# EAGLE design control (EAGLE 5.07)
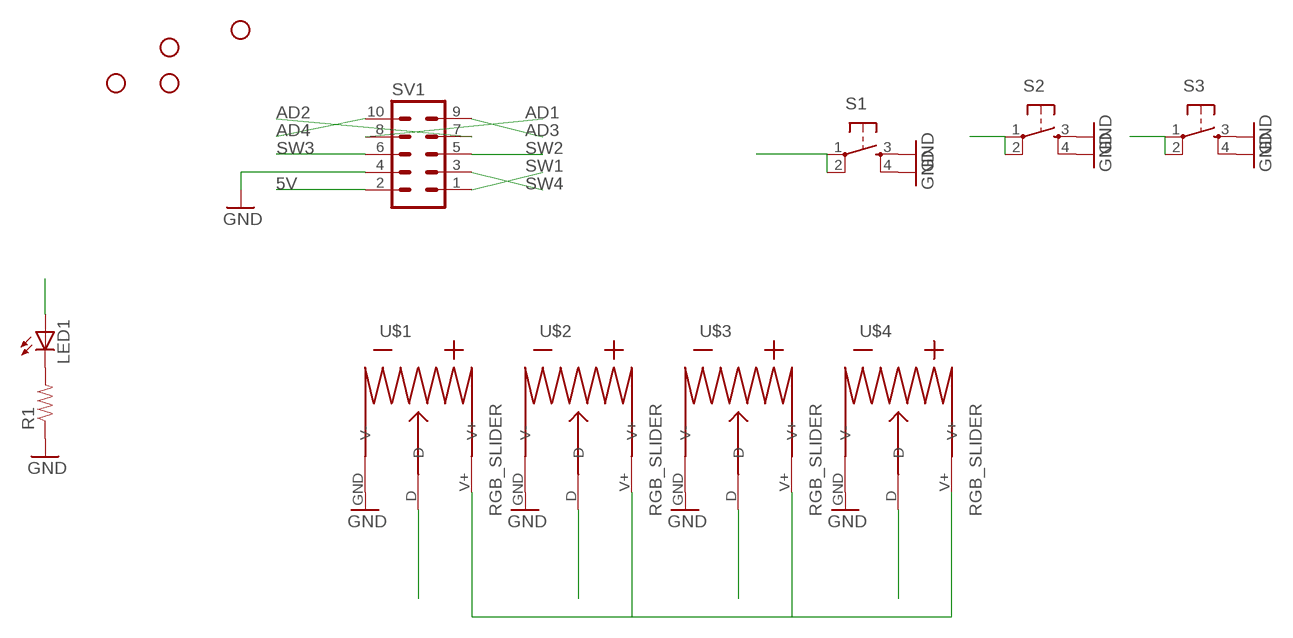
[diagram p0: schematic, sheet 1]

## Parts
JP1  STAND-OFF  [STAND-OFF]
JP2  STAND-OFF  [STAND-OFF]
JP3  STAND-OFF  [STAND-OFF]
JP4  STAND-OFF  [STAND-OFF]
LED1  LED5MM  [LED5MM]
R1  RESISTORPTH1  [AXIAL-0.3]
S1  TAC_SWITCHPTH  [TACTILE-PTH]
S2  TAC_SWITCHPTH  [TACTILE-PTH]
S3  TAC_SWITCHPTH  [TACTILE-PTH]
SV1  ML10  [ML10]
U$1  RGB_SLIDER  [RGB_SLIDER]
U$2  RGB_SLIDER  [RGB_SLIDER]
U$3  RGB_SLIDER  [RGB_SLIDER]
U$4  RGB_SLIDER  [RGB_SLIDER]

## Nets
5V: SV1.2 U$1.V+ U$2.V+ U$3.V+ U$4.V+
AD1: SV1.8 U$1.D
AD2: SV1.7 U$2.D
AD3: SV1.9 U$3.D
AD4: SV1.10 U$4.D
GND: R1.P$1 S1.3 S1.4 S2.3 S2.4 S3.3 S3.4 SV1.4 U$1.GND(V-) U$2.GND(V-) U$3.GND(V-) U$4.GND(V-)
N$1: LED1.K(C) R1.P$2
SW1: LED1.A SV1.1
SW2: S1.1 S1.2 SV1.5
SW3: S2.1 S2.2 SV1.6
SW4: S3.1 S3.2 SV1.3

## Library data of the parts
JP1-JP4 = SparkFun:STAND-OFF: Stand Off This is the mechanical footprint for a #4 phillips button head screw. Use the keepout ring to avoid running the screw head into surrounding components. SKU : PRT-00447
LED1 = SparkFun:LED: LEDs Standard schematic elements and footprints for 5mm, 3mm, 1206, and 0603 sized LEDs. 5mm - Spark Fun Electronics SKU : COM-00529 (and others)
R1 = SparkFun:RESISTOR: Resistor Basic schematic elements and footprints for 0603, 1206, and PTH 1/10th watt (small) resistors.
S1-S3 = SparkFun:TAC_SWITCH: Momentary Switch Button commonly used for reset or general input. Spark Fun Electronics SKU : COM-00097
SV1 = con-harting-ml:ML10: HARTING
U$1-U$4 = RGB_SLIDER:RGB_SLIDER

## Board
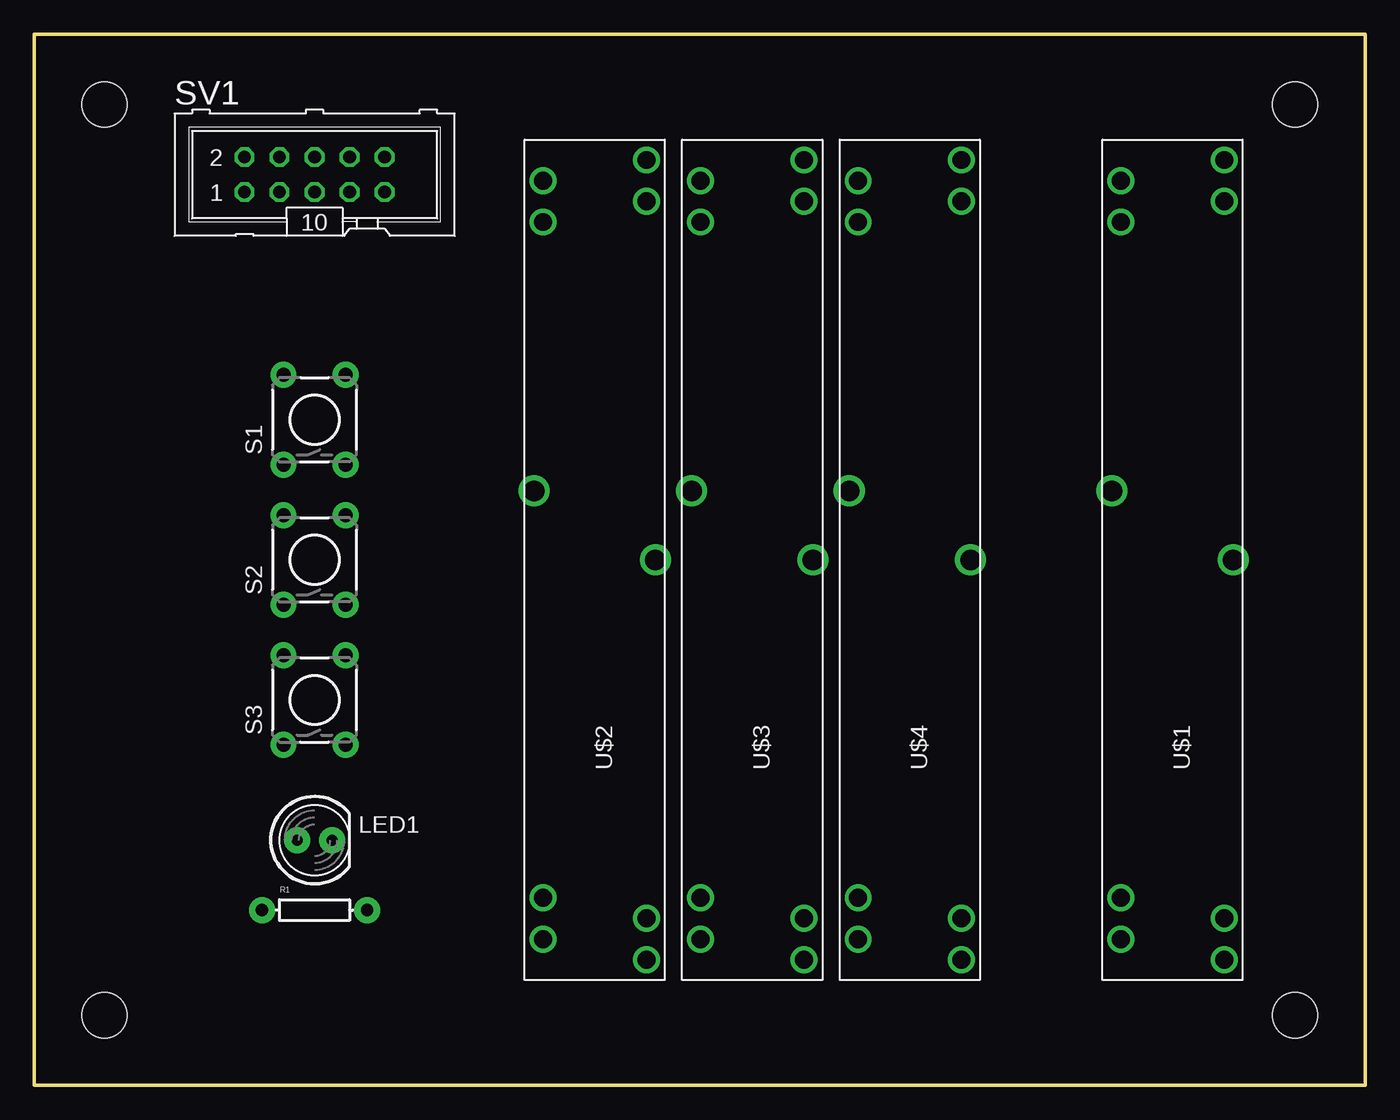
[diagram p1: board, top side]
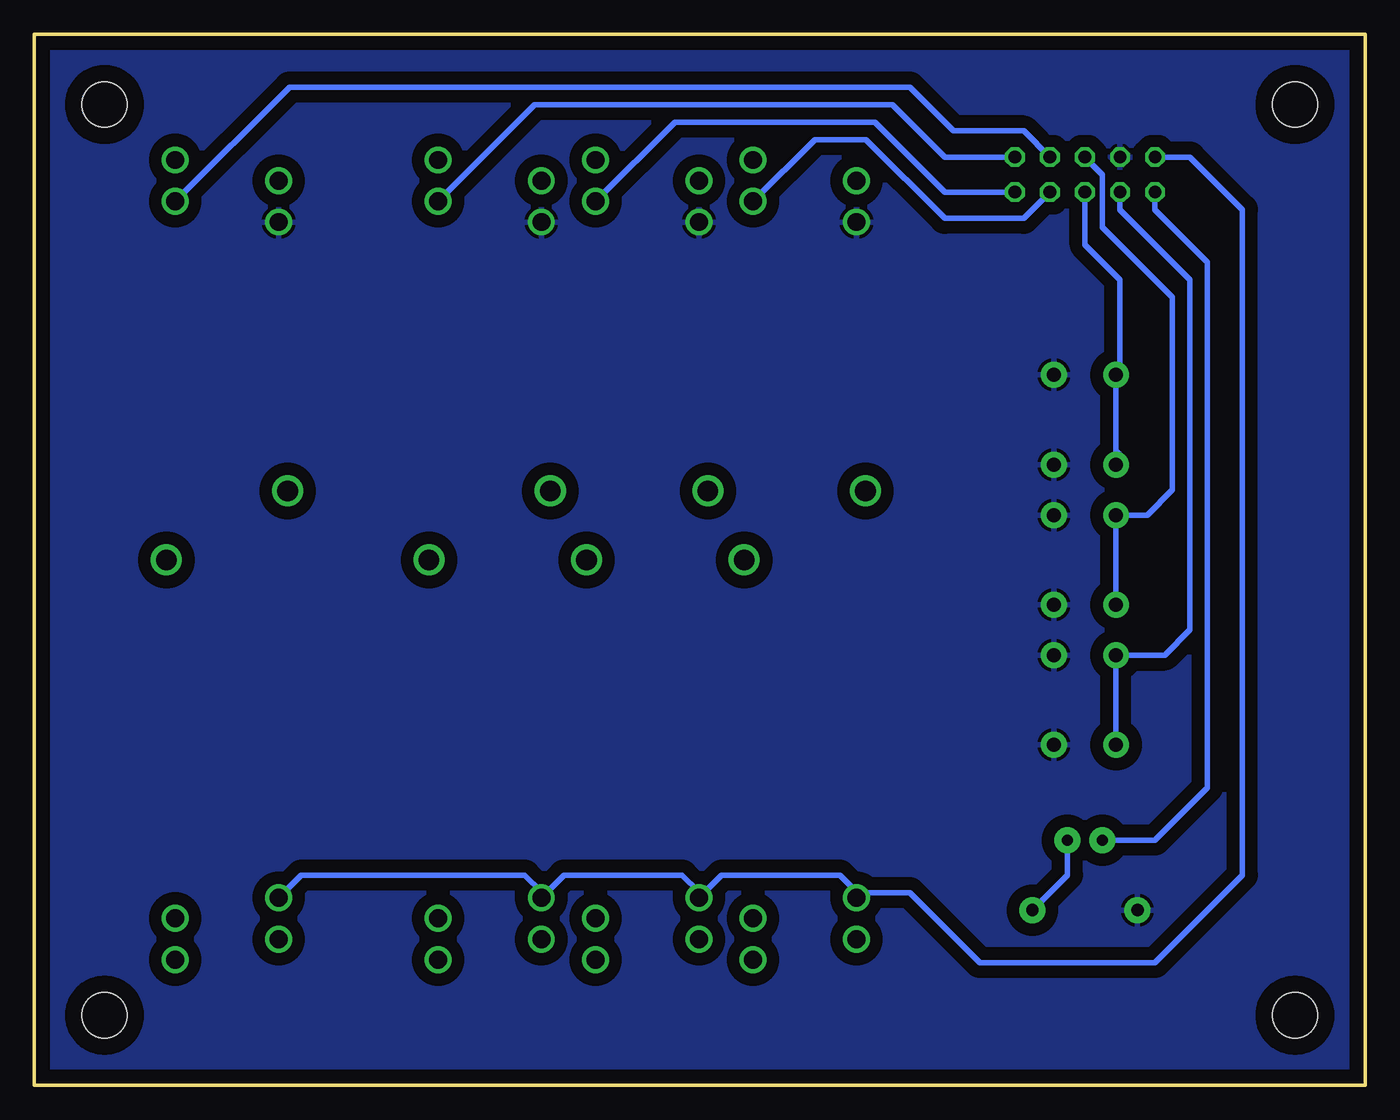
[diagram p2: board, bottom side, seen from below]

Size 96.52 x 76.2 mm. Coordinates in mm from the lower left corner, seen from the top.
Outline: 0,0 96.52,0 96.52,76.2 0,76.2 0,0
Copper layers (1*16): Top 0.035mm / dielectric 1.5mm / Bottom 0.035mm
Design rules "default": minimum track width 10mil, minimum drill 24mil, track to track 8mil, track to pad 8mil, pad to pad 8mil, via to via 8mil, smd to smd 8mil, copper to edge 40mil, drill to drill 8mil, minimum pad ring 10mil, minimum via ring 8mil, stop-mask expansion 4mil, vias tented up to drill 0mil, thermal gap 10mil

### Footprints (pad centres in the part's own frame; a part is rotated, then mirrored left to right if it is on the bottom)
STAND-OFF = hole 3.302: 0,0
LED5MM = drill 0.813 pad 1.88 round: A -1.27,0; K 1.27,0
AXIAL-0.3 = drill 0.9 pad 1.88 round: P$1 -3.81,0; P$2 3.81,0
TACTILE-PTH = drill 1.016 pad 1.88 round: 1 -3.251,2.261; 2 3.251,2.261; 3 -3.251,-2.261; 4 3.251,-2.261
ML10 = drill 0.914 octagon: 1 -5.08,-1.27; 2 -5.08,1.27; 3 -2.54,-1.27; 4 -2.54,1.27; 5 0,-1.27; 6 0,1.27; 7 2.54,-1.27; 8 2.54,1.27; 9 5.08,-1.27; 10 5.08,1.27
RGB_SLIDER = drill 1.3 round: 1' -3.75,26; 2 3.75,27.5; 2' -3.75,29; 3 3.75,-27.5; 3' -3.75,-29; D -3.75,-26; GND 3.75,-24.5; V+ 3.75,24.5 | drill 1.5 round: P$6 -4.4,0; P$8 4.4,-5

### Placement (x,y rotation side)
JP1  5.08,5.08 0 top
JP2  5.08,71.12 0 top
JP3  91.44,71.12 0 top
JP4  91.44,5.08 0 top
LED1  20.32,17.78 0 top
R1  20.32,12.7 0 top
S1  20.32,48.26 90 top
S2  20.32,38.1 90 top
S3  20.32,27.94 90 top
SV1  20.32,66.04 0 top
U$1  82.55,38.1 180 top
U$2  40.64,38.1 180 top
U$3  52.07,38.1 180 top
U$4  63.5,38.1 180 top

### Tracks (layer width: path | path; a pad name or v marks a point on that pad's centre or on a via)
5V
  Bottom 0.406: SV1.2 12.7,67.31 8.89,63.5 8.89,15.24 15.24,8.89 27.94,8.89 33.02,13.97 36.52,13.97 U$2.V+ 36.89,14.03 38.1,15.24 46.68,15.24 U$3.V+ 48.32,14.03 49.53,15.24 58.11,15.24 U$4.V+ 59.75,14.03 60.96,15.24 77.16,15.24 U$1.V+
AD1
  Bottom 0.406: SV1.8 24.77,69.22 29.84,69.22 33.02,72.39 78.01,72.39 U$1.D
AD2
  Bottom 0.406: SV1.7 24.77,62.87 30.48,62.87 36.2,68.58 39.91,68.58 U$2.D
AD3
  Bottom 0.406: SV1.9 30.48,64.77 35.56,69.85 50.07,69.85 U$3.D
AD4
  Bottom 0.406: SV1.10 30.48,67.31 34.29,71.12 60.23,71.12 U$4.D
GND
  pour Bottom (isolate 0.914): 0,0 96.52,0 96.52,76.2 0,76.2
N$1
  Bottom 0.406: LED1.K 21.59,15.24 R1.P$2
SW1
  Bottom 0.406: SV1.1 15.24,63.5 11.43,59.69 11.43,21.59 15.24,17.78 LED1.A
SW2
  Bottom 0.406: SV1.5 20.32,60.96 17.78,58.42 17.78,51.79 S1.2 18.06,46 17.78,45.72 17.78,45.29 S1.1
SW3
  Bottom 0.406: SV1.6 19.05,66.04 19.05,62.23 13.97,57.15 13.97,43.18 15.8,41.35 S2.2 S2.1
SW4
  Bottom 0.406: SV1.3 17.78,63.5 12.7,58.42 12.7,33.02 14.53,31.19 S3.2 S3.1